# EAGLE design Sensors (EAGLE 7.7.0)
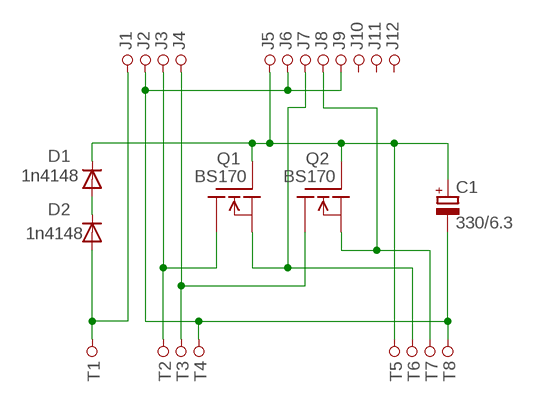
[diagram p0: schematic, sheet 1]

## Parts
C1  330/6.3  CPOL-EUE2.5-6  [E2,5-6]
D1  1n4148  1N4148  [DO34Z7]
D2  1n4148  1N4148  [DO34Z7]
J1  PINHDR-1X1  [HDR1X1]
J2  PINHDR-1X1  [HDR1X1]
J3  PINHDR-1X1  [HDR1X1]
J4  PINHDR-1X1  [HDR1X1]
J5  PINHDR-1X1  [HDR1X1]
J6  PINHDR-1X1  [HDR1X1]
J7  PINHDR-1X1  [HDR1X1]
J8  PINHDR-1X1  [HDR1X1]
J9  PINHDR-1X1  [HDR1X1]
J10  PINHDR-1X1  [HDR1X1]
J11  PINHDR-1X1  [HDR1X1]
J12  PINHDR-1X1  [HDR1X1]
Q1  BS170  NFET  [TO92]
Q2  BS170  NFET  [TO92]
T1  PINHDR-1X1  [HDR1X1]
T2  PINHDR-1X1  [HDR1X1]
T3  PINHDR-1X1  [HDR1X1]
T4  PINHDR-1X1  [HDR1X1]
T5  PINHDR-1X1  [HDR1X1]
T6  PINHDR-1X1  [HDR1X1]
T7  PINHDR-1X1  [HDR1X1]
T8  PINHDR-1X1  [HDR1X1]

## Nets
N$1: C1.+ D1.C J5.1(.) Q1.2(G) Q2.2(G) T5.1(.)
N$2: C1.- J2.1(.) J6.1(.) J9.1(.) T4.1(.) T8.1(.)
N$3: D2.A J1.1(.) T1.1(.)
N$4: D1.A D2.C
N$5: J3.1(.) Q1.3(D) T2.1(.)
N$6: J4.1(.) Q2.3(D) T3.1(.)
N$7: J7.1(.) Q1.1(S) T6.1(.)
N$8: J8.1(.) Q2.1(S) T7.1(.)
Unconnected: J10.1(.) J11.1(.) J12.1(.)

## Library data of the parts
C1 = Passive:CPOL-EU: POLARIZED CAPACITOR, European symbol
D1 D2 = DiodeRect:1N4148
J1-J12 T1-T8 = Header:PINHDR-1X1
Q1 Q2 = Trans:NFET: N-Channel Enhancement MOSFET

## Net classes
1 power: width 0.61 mm, drill 0.406 mm, clearance 0.203 mm
2 gnd: width 0.305 mm, drill 0.406 mm, clearance 0.203 mm
3 power usb: width 0.508 mm, drill 0.406 mm, clearance 0.203 mm
4 vcc2: width 0.914 mm, drill 0.305 mm, clearance 0.305 mm

## Board
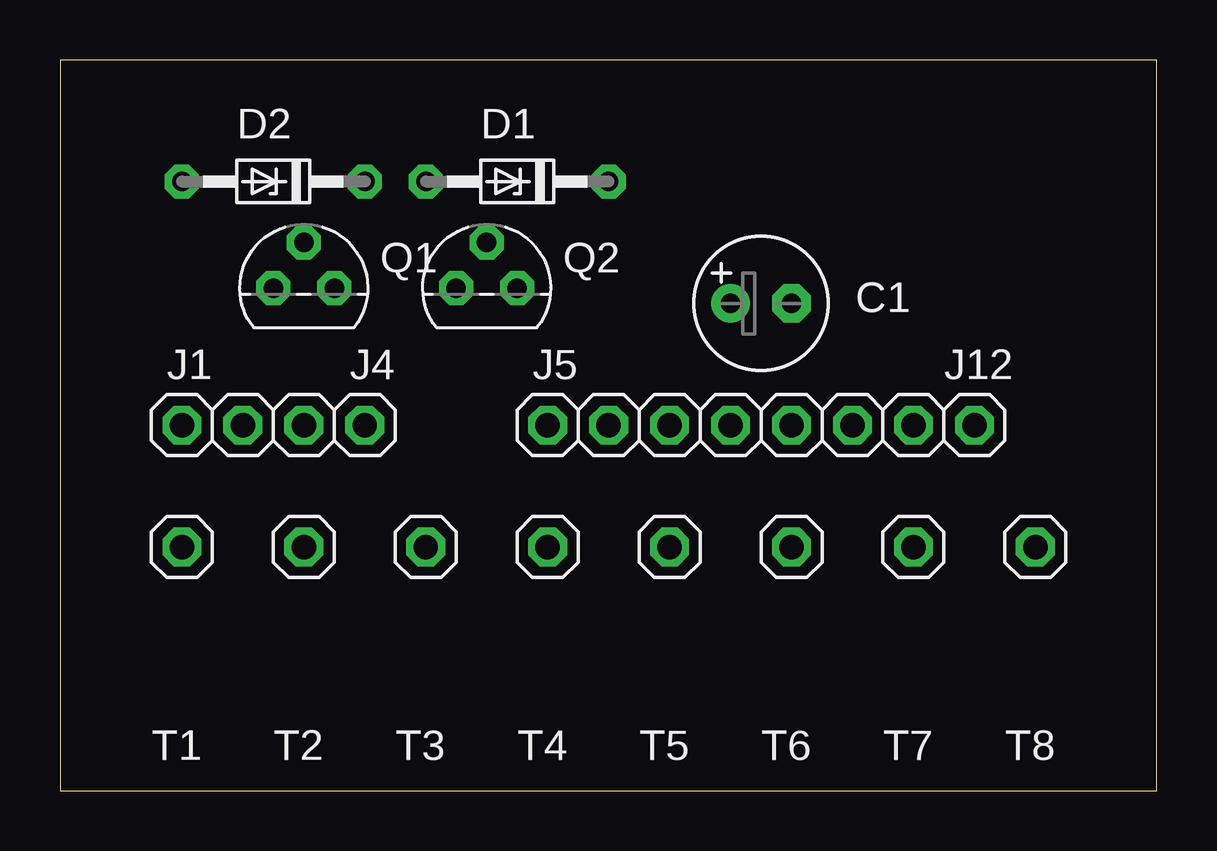
[diagram p1: board, top side]
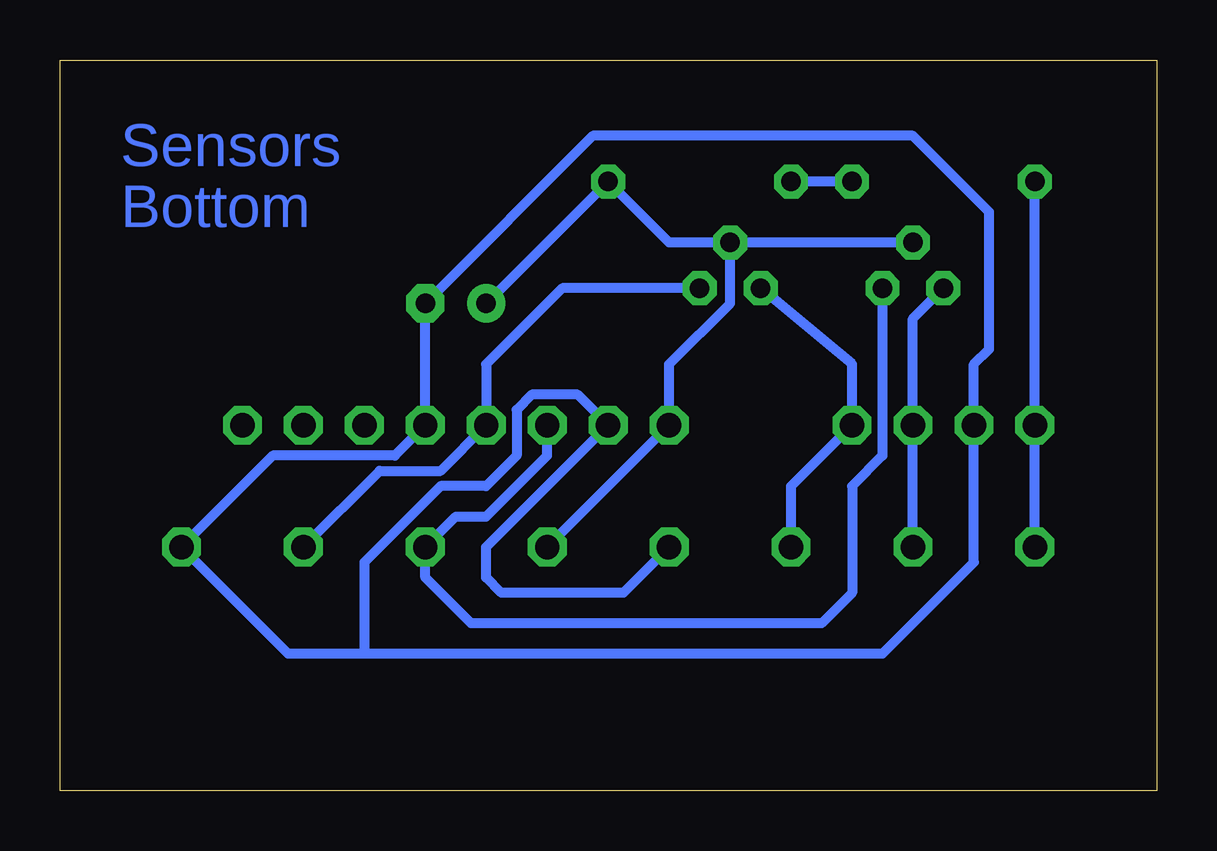
[diagram p2: board, bottom side, seen from below]

Size 45.7 x 30.47 mm. Coordinates in mm from the lower left corner, seen from the top.
Outline: 0,0 45.7,0 45.7,30.47 0,30.47 0,0
Copper layers 16: Bottom 0.035mm
Design rules "eC_1Layer_PClass6_BaseCopperO35_eCDefault": minimum track width 0.15mm, minimum drill 0.35mm, track to track 0.15mm, track to pad 0.15mm, pad to pad 0.15mm, via to via 0.15mm, smd to smd 0mil, copper to edge 0.25mm, drill to drill 0.35mm, minimum pad ring 0.3mm, minimum via ring 0.3mm, stop-mask expansion 0mil, vias tented up to drill 0.45mm, thermal gap 0.2mm

### Footprints (pad centres in the part's own frame; a part is rotated, then mirrored left to right if it is on the bottom)
E2,5-6 = drill 0.813 pad 1.6: + -1.27,0 | drill 0.813 pad 1.6 octagon: - 1.27,0
DO34Z7 = drill 0.813 octagon: A 3.81,0; C -3.81,0
HDR1X1 = drill 1.016 octagon: 1 0,0
TO92 = drill 0.813 octagon: 1 1.27,0; 2 0,1.905; 3 -1.27,0

### Placement (x,y rotation side)
C1  29.21,20.32 0 top
D1  19.05,25.4 180 top
D2  8.89,25.4 180 top
J1  5.08,15.24 0 top
J2  7.62,15.24 0 top
J3  10.16,15.24 0 top
J4  12.7,15.24 0 top
J5  20.32,15.24 0 top
J6  22.86,15.24 0 top
J7  25.4,15.24 0 top
J8  27.94,15.24 0 top
J9  30.48,15.24 0 top
J10  33.02,15.24 0 top
J11  35.56,15.24 0 top
J12  38.1,15.24 0 top
Q1  10.16,20.95 0 top
Q2  17.78,20.95 0 top
T1  5.08,10.16 0 top
T2  10.16,10.16 0 top
T3  15.24,10.16 0 top
T4  20.32,10.16 0 top
T5  25.4,10.16 0 top
T6  30.48,10.16 0 top
T7  35.56,10.16 0 top
T8  40.64,10.16 0 top

### Tracks (layer width: path | path; a pad name or v marks a point on that pad's centre or on a via)
N$1
  Bottom 0.406: Q1.2 Q2.2 | Q2.2 20.32,22.86 D1.C C1.+ | T5.1 J5.1 20.32,17.78 17.78,20.32 Q2.2
N$2
  Bottom 0.406: T4.1 22.23,8.25 27.3,8.25 27.94,8.89 27.94,10.16 J6.1 24.13,16.51 26.04,16.51 26.67,15.88 26.67,13.97 27.94,12.7 29.84,12.7 33.02,9.53 33.02,5.71 | 33.02,5.71 11.43,5.71 7.62,9.53 J2.1 7.62,17.78 6.99,18.41 6.99,24.13 10.16,27.3 23.5,27.3 C1.- J9.1 31.75,13.97 36.83,13.97 T8.1 36.2,5.71 33.02,5.71
N$3
  Bottom 0.406: T1.1 J1.1 D2.A
N$4
  Bottom 0.406: D2.C D1.A
N$5
  Bottom 0.406: T2.1 J3.1 10.16,19.68 Q1.3
N$6
  Bottom 0.406: T3.1 15.24,12.7 J4.1 12.7,17.78 Q2.3
N$7
  Bottom 0.406: J7.1 25.4,13.97 27.94,11.43 29.21,11.43 T6.1 30.48,8.89 28.57,6.99 13.97,6.99 12.7,8.25 12.7,12.7 11.43,13.97 Q1.1
N$8
  Bottom 0.406: Q2.1 24.77,20.95 27.94,17.78 J8.1 29.84,13.34 32.38,13.34 T7.1

### Text on the board
Bottom: Sensors | Bottom